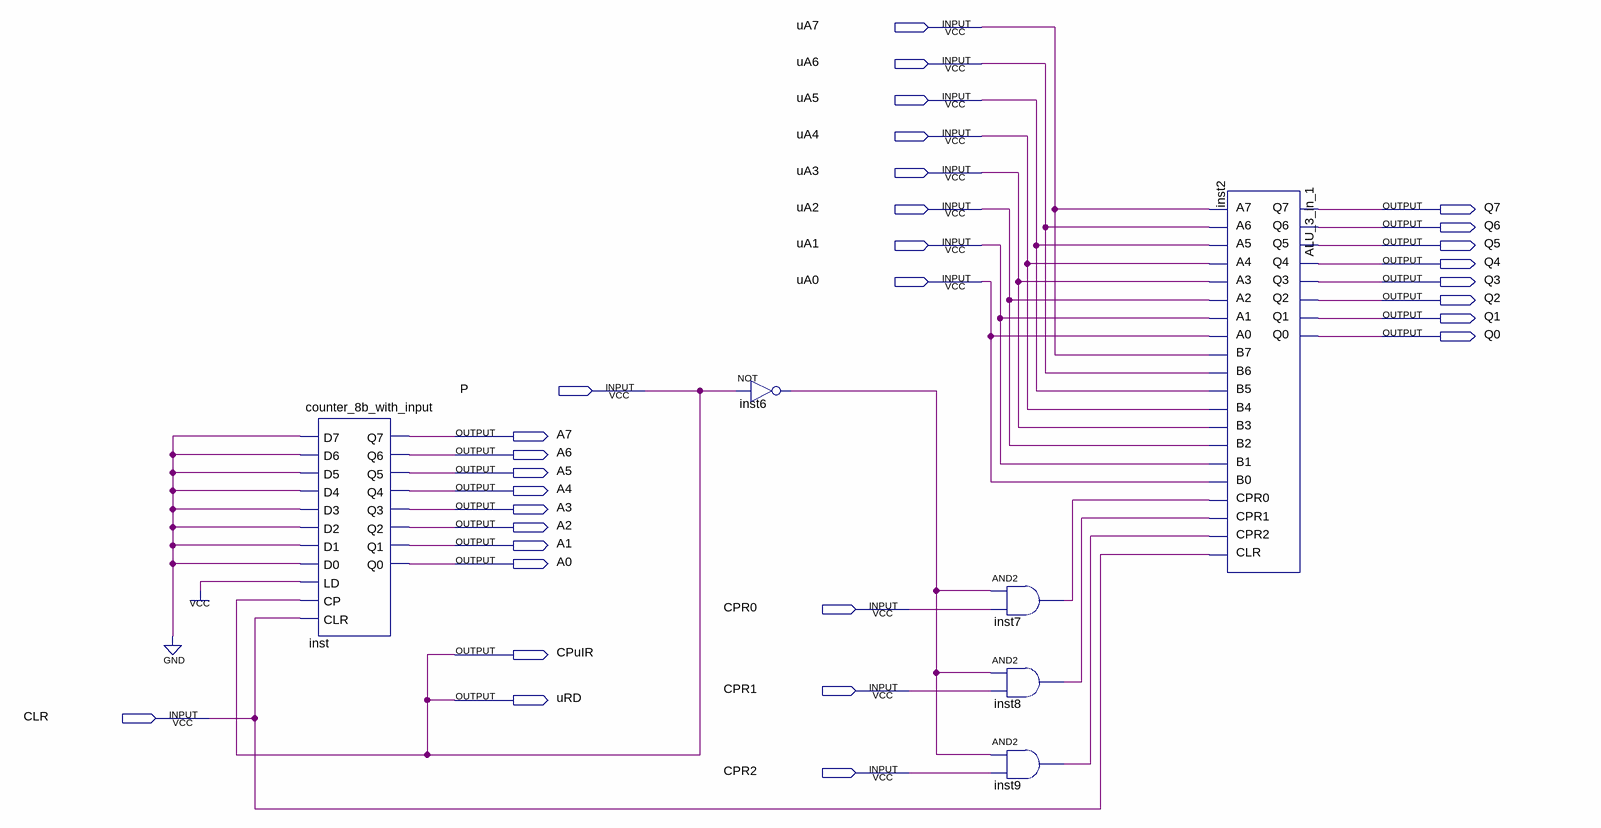
[diagram p0: schematic sheet]
// Quartus schematic microprogram_adder.bdf as structural Verilog: 6 symbols, 31 pins
module microprogram_adder (
  input  uA7,
  input  uA6,
  input  uA5,
  input  uA4,
  input  uA3,
  input  uA2,
  input  uA1,
  input  uA0,
  input  P,
  input  CPR0,
  input  CPR1,
  input  CLR,
  input  CPR2,
  output Q7,
  output Q6,
  output Q5,
  output Q4,
  output Q3,
  output Q2,
  output Q1,
  output Q0,
  output A7,
  output A6,
  output A5,
  output A4,
  output A3,
  output A2,
  output A1,
  output A0,
  output CPuIR,
  output uRD
);

  wire inst6_out, inst7_out, inst8_out, inst9_out;

  counter_8b_with_input inst (
    .D7(1'b0), .D6(1'b0), .D5(1'b0), .D4(1'b0), .D3(1'b0), .D2(1'b0), .D1(1'b0), .D0(1'b0), .LD(1'b1),
    .CP(P), .CLR(CLR), .Q7(A7), .Q6(A6), .Q5(A5), .Q4(A4), .Q3(A3), .Q2(A2), .Q1(A1), .Q0(A0));
  not inst6 (inst6_out, P);
  and inst7 (inst7_out, inst6_out, CPR0);
  and inst8 (inst8_out, inst6_out, CPR1);
  and inst9 (inst9_out, inst6_out, CPR2);
  ALU_3_in_1 inst2 (
    .A0(uA0), .A1(uA1), .A2(uA2), .A3(uA3), .A4(uA4), .A5(uA5), .A6(uA6), .A7(uA7), .B0(uA0), .B1(uA1),
    .B2(uA2), .B3(uA3), .B4(uA4), .B5(uA5), .B6(uA6), .B7(uA7), .CPR0(inst7_out), .CPR1(inst8_out),
    .CPR2(inst9_out), .CLR(CLR), .Q0(Q0), .Q1(Q1), .Q2(Q2), .Q3(Q3), .Q4(Q4), .Q5(Q5), .Q6(Q6), .Q7(Q7));

  assign CPuIR = P;
  assign uRD = P;
endmodule
